# Altium schematic sheet Main.SchDoc
size B; SheetNumber: 1; SheetTotal: 1
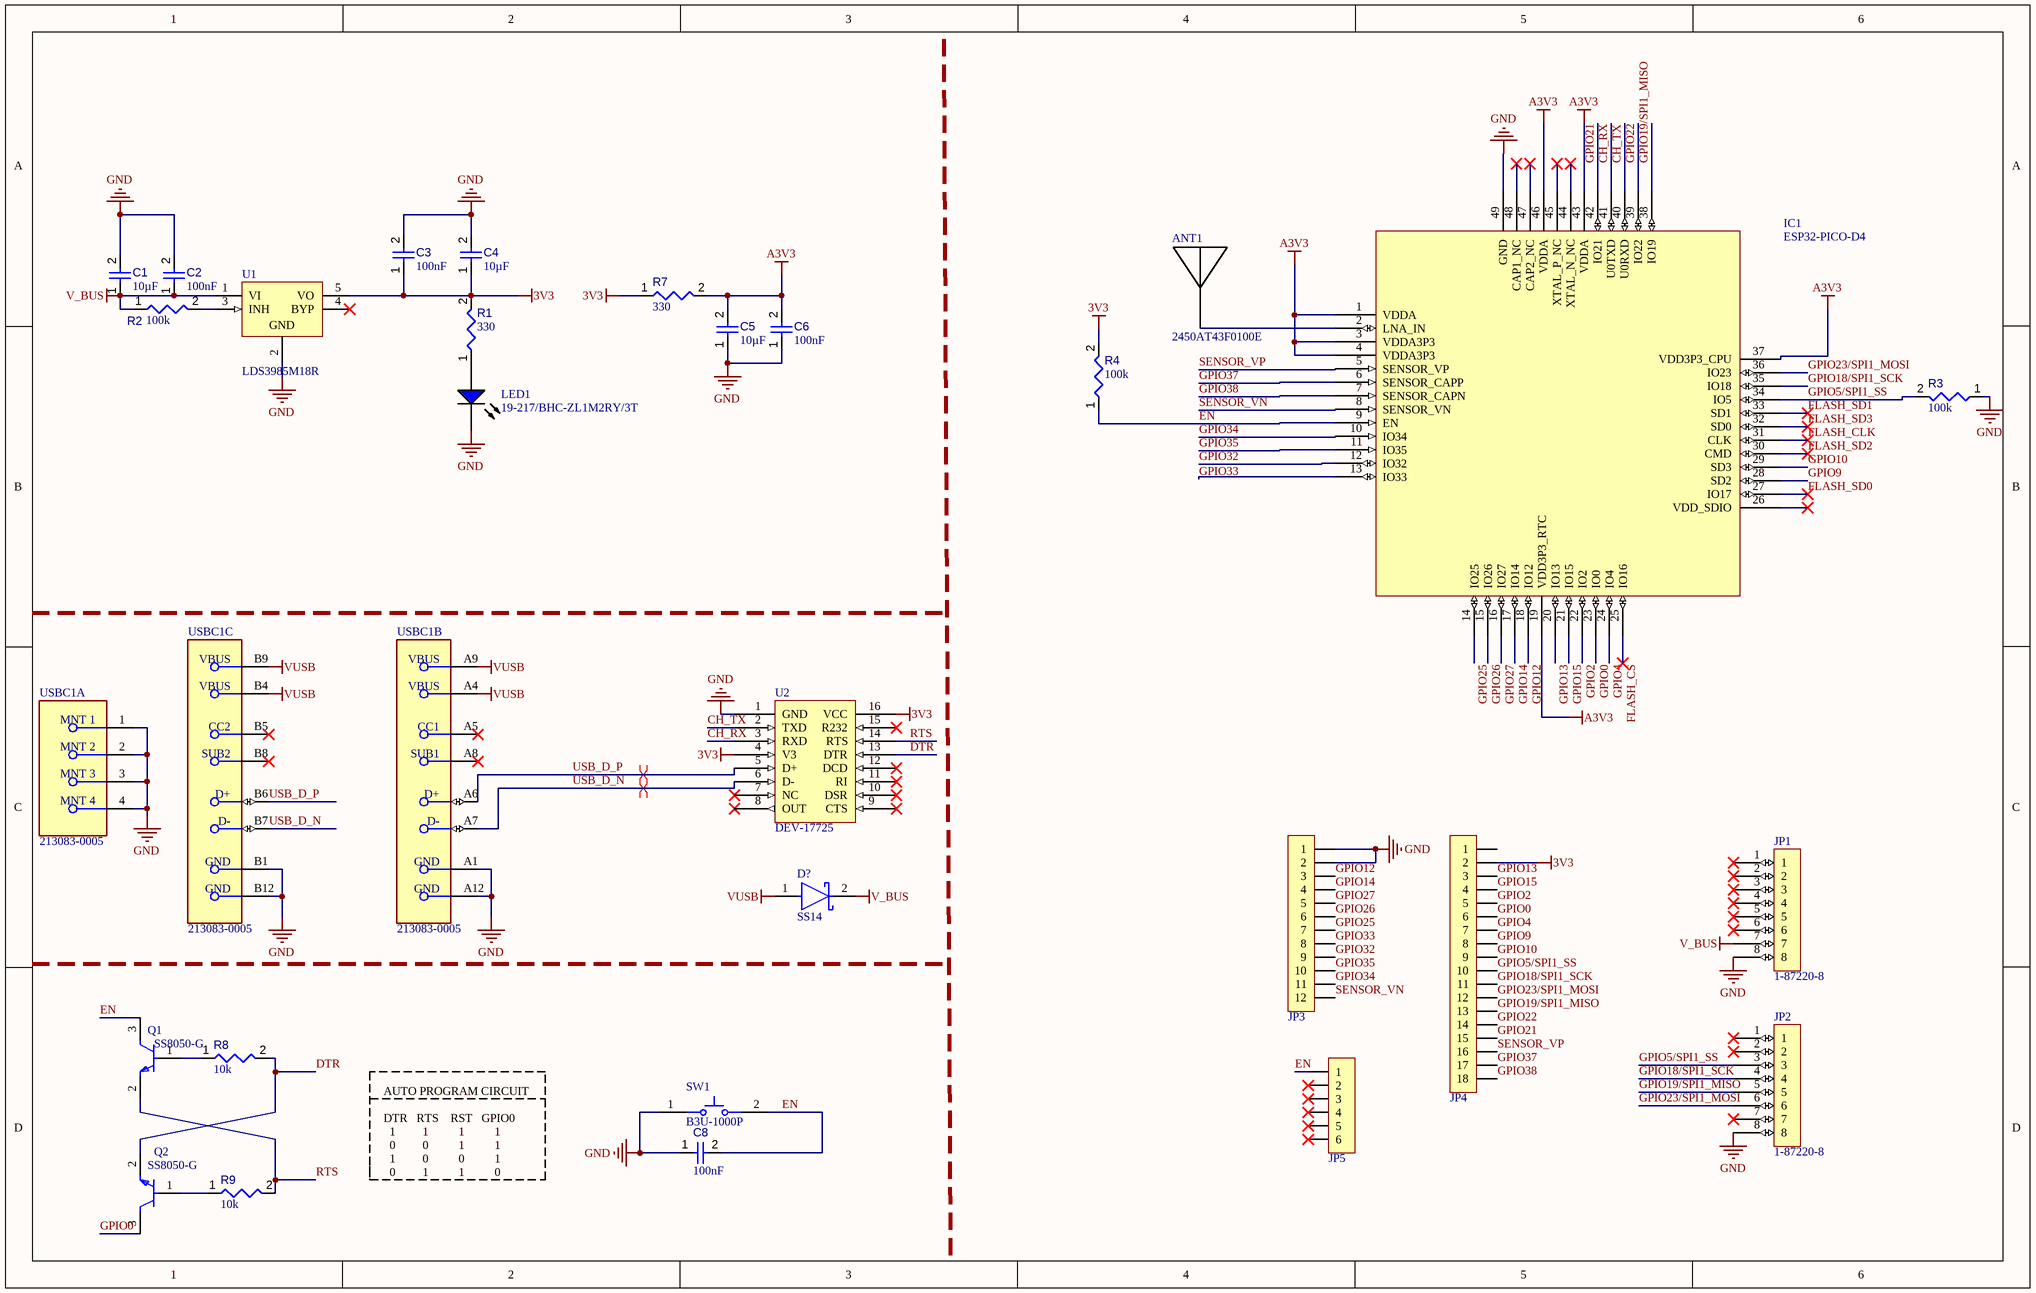
[diagram p0: Main.SchDoc]

## Parts
ANT1  2450AT43F0100E  [2450AT43F0100E-Footprint-1]
C1  value 10µF  [CAPC0603(1608)100_L]  (hidden comment: Capacitor 10µF +/-20% 10V 0603)
C2  value 100nF  [CAPC0402(1005)60_L]  (hidden comment: Capacitor 100nF +/-20% 10V 0402)
C3  value 100nF  [CAPC0402(1005)60_L]  (hidden comment: Capacitor 100nF +/-20% 10V 0402)
C4  value 10µF  [CAPC0603(1608)100_L]  (hidden comment: Capacitor 10µF +/-20% 10V 0603)
C5  value 10µF  [CAPC0603(1608)100_L]  (hidden comment: Capacitor 10µF +/-20% 10V 0603)
C6  value 100nF  [CAPC0402(1005)60_L]  (hidden comment: Capacitor 100nF +/-20% 10V 0402)
C8  value 100nF  [CAPC0402(1005)60_L]  (hidden comment: Capacitor 100nF +/-20% 10V 0402)
D?  SS14  [DIOM4427X25N]
IC1  ESP32-PICO-D4  [QFN50P700X700X104_HS-49N]
JP1  1-87220-8  [1-87220-8-Footprint-1]
JP2  1-87220-8  [1-87220-8-Footprint-1]
JP3  HDR-1X12  [HDR2.54-LI-12P]  (value not drawn)
JP4  HDR-1X18  [HDR2.54-LI-18P]  (value not drawn)
JP5  HDR-1X6  [HDR2.54-LI-6P]  (value not drawn)
LED1  19-217/BHC-ZL1M2RY/3T  [EVRL-0603-2_V]
Q1  SS8050-G  [FP-SS8050-G-IPC_A]
Q2  SS8050-G  [FP-SS8050-G-IPC_A]
R1  value 330  [RESC0402(1005)_L]  (hidden comment: Resistor 330R +/-5 % 0402 63 mW)
R2  value 100k  [RESC0402(1005)_L]  (hidden comment: 100KR2F)
R3  value 100k  [RESC0402(1005)_L]  (hidden comment: 100KR2F)
R4  value 100k  [RESC0402(1005)_L]  (hidden comment: 100KR2F)
R7  value 330  [RESC0402(1005)_L]  (hidden comment: Resistor 330R +/-5 % 0402 63 mW)
R8  value 10k  [RESC0402(1005)_L]  (hidden comment: 10KR2F)
R9  value 10k  [RESC0402(1005)_L]  (hidden comment: 10KR2F)
SW1  B3U-1000P  [OMRON-B3U-1000_V]
U1  LDS3985M18R  [SOT23-5L_N]
U2  DEV-17725  [DEV-17725-Footprint-1]
USBC1  213083-0005  [FP-213083-0005-MFG]  (parts A,B,C of 3)

## Nets
3V3: C3.1 C4.1 JP4.2 R1.2 R4.2 R7.1 U1.5(VO) U2.4(V3) U2.16(VCC)
A3V3: C5.2 C6.2 IC1.1(VDDA) IC1.3(VDDA3P3) IC1.4(VDDA3P3) IC1.19(VDD3P3_RTC) IC1.37(VDD3P3_CPU) IC1.43(VDDA) IC1.46(VDDA) R7.2
GND: C1.2 C2.2 C3.2 C4.2 C5.1 C6.1 C8.1 IC1.49(GND) JP1.8 JP2.8 JP3.1 JP3.2 LED1.2(K) R3.1 SW1.1 U1.2(GND) U2.1(GND) USBC1.1(MNT_1) USBC1.2(MNT_2) USBC1.3(MNT_3) USBC1.4(MNT_4) USBC1.A1(GND) USBC1.A12(GND) USBC1.B1(GND) USBC1.B12(GND)
V_BUS: C1.1 C2.1 D?.2(C) JP1.7 R2.1 U1.1(VI)
VUSB: D?.1(A) USBC1.A4(VBUS) USBC1.A9(VBUS) USBC1.B4(VBUS) USBC1.B9(VBUS)
CH_RX: IC1.41(U0TXD) U2.3(RXD)
CH_TX: IC1.40(U0RXD) U2.2(TXD)
DTR: Q2.2(E) R8.2 U2.13(DTR)
EN: C8.2 IC1.9(EN) JP5.1 Q1.3(C) R4.1 SW1.2
FLASH_CLK: IC1.31(CLK)
FLASH_CS: IC1.25(IO16)
FLASH_SD0: IC1.27(IO17)
FLASH_SD1: IC1.33(SD1)
FLASH_SD2: IC1.30(CMD)
FLASH_SD3: IC1.32(SD0)
GPIO0: IC1.23(IO0) JP4.6 Q2.3(C)
GPIO2: IC1.22(IO2) JP4.5
GPIO4: IC1.24(IO4) JP4.7
GPIO5/SPI1_SS: IC1.34(IO5) JP2.3 JP4.10 R3.2
GPIO9: IC1.28(SD2) JP4.8
GPIO10: IC1.29(SD3) JP4.9
GPIO12: IC1.18(IO12) JP3.3
GPIO13: IC1.20(IO13) JP4.3
GPIO14: IC1.17(IO14) JP3.4
GPIO15: IC1.21(IO15) JP4.4
GPIO18/SPI1_SCK: IC1.35(IO18) JP2.4 JP4.11
GPIO19/SPI1_MISO: IC1.38(IO19) JP2.5 JP4.13
GPIO21: IC1.42(IO21) JP4.15
GPIO22: IC1.39(IO22) JP4.14
GPIO23/SPI1_MOSI: IC1.36(IO23) JP2.6 JP4.12
GPIO25: IC1.14(IO25) JP3.7
GPIO26: IC1.15(IO26) JP3.6
GPIO27: IC1.16(IO27) JP3.5
GPIO32: IC1.12(IO32) JP3.9
GPIO33: IC1.13(IO33) JP3.8
GPIO34: IC1.10(IO34) JP3.11
GPIO35: IC1.11(IO35) JP3.10
GPIO37: IC1.6(SENSOR_CAPP) JP4.17
GPIO38: IC1.7(SENSOR_CAPN) JP4.18
RTS: Q1.2(E) R9.2 U2.14(RTS)
SENSOR_VN: IC1.8(SENSOR_VN) JP3.12
SENSOR_VP: IC1.5(SENSOR_VP) JP4.16
USB_D_N: U2.6(D-) USBC1.A7(D-) USBC1.B7(D-)
USB_D_P: U2.5(D+) USBC1.A6(D+) USBC1.B6(D+)
NetANT1_1: ANT1.1 IC1.2(LNA_IN)
NetLED1_1: LED1.1(A) R1.1
NetQ1_1: Q1.1(B) R8.1
NetQ2_1: Q2.1(B) R9.1
NetR2_2: R2.2 U1.3(INH)

Not connected (* = marked no-connect by the designer): IC1 26(VDD_SDIO)* 44(XTAL_N_NC)* 45(XTAL_P_NC)* 47(CAP2_NC)* 48(CAP1_NC)*; JP1 1* 2* 3* 4* 5* 6*; JP2 1* 2* 7*; JP4 1; JP5 2* 3* 4* 5* 6*; U1 4(BYP)*; U2 7(NC)* 8(OUT)* 9(CTS)* 10(DSR)* 11(RI)* 12(DCD)* 15(R232)*; USBC1 A5(CC1)* A8(SUB1)* B5(CC2)* B8(SUB2)*

## Layout directives
differential pair: USB_D_N, USB_D_P

## Notes on the sheet
- AUTO PROGRAM CIRCUIT
  DTR   RTS    RST   GPIO0
  1         1          1          1
  0         0          1          1
  1         0          0          1
  0         1          1          0

## Library data of the parts
ANT1 = CMP-00025-00003-1: Antenna Chip 1dBi Gain 2500MHz 2-Pin T/R
C1 C4 C5 = CMP-001-00075-4: Chip Capacitor, 10µF +/-20%, 10V, 0603, Thickness 1 mm; Tolerance: 10%; Voltage Rating: 10V; Max Operating Temperature: 85°C; Pins: 2; Case/Package: 0603; Mounting Technology: SMT; Min Operating Temperature: -55°C
C2 C3 C6 C8 = CMP-001-00061-3: Chip Capacitor, 100nF +/-20%, 10V, 0402, Thickness 0.6 mm; Tolerance: 20%; Mounting Technology: SMT; Voltage Rating: 10V; Max Operating Temperature: 85°C; Pins: 2; Case/Package: 0402; Min Operating Temperature: -55°C
D? = CMP-004-00031-1: Schottky Diodes & Rectifiers SMA 40V 1.0A; ComponentLink1Description: Mouser Link; ComponentLink1URL: https://www.mouser.com/ProductDetail/onsemi-Fairchild/SS14?qs=mVVXn4M53U%252BvrBaFv5vr4w%3D%3D
IC1 = CMP-021-00007-1: RF System on a Chip - SoC SIP module ESP32 with 4MByte Flash, Dual Core MCU, Wi-Fi & Bluetooth Combo, LGA48-pin, 7*7mm
JP1 JP2 = CMP-002-00072-1: Conn Unshrouded Header HDR 1x8 POS 2.54mm Solder ST Thru-Hole Carton
JP3 = Header 12: 12P接插件; 联系卖家，免费查找封装: 唯一出售店铺网址https://shop463601444.taobao.com; 封装库来自淘宝卖家ID:黄晶宝石: 其他店铺购入均为盗版假冒封装库，请立即申请退款，本店现金奖励20~200元; BOM名称: 12P接插件
JP4 = Header 18: 18P接插件; 联系卖家，免费查找封装: 唯一出售店铺网址https://shop463601444.taobao.com; 封装库来自淘宝卖家ID:黄晶宝石: 其他店铺购入均为盗版假冒封装库，请立即申请退款，本店现金奖励20~200元; BOM名称: 18P接插件
JP5 = Header 6: 6P接插件; 联系卖家，免费查找封装: 唯一出售店铺网址https://shop463601444.taobao.com; 封装库来自淘宝卖家ID:黄晶宝石: 其他店铺购入均为盗版假冒封装库，请立即申请退款，本店现金奖励20~200元; BOM名称: 6P接插件
LED1 = CMP-007-00003-2: Chip LED, Blue, 5 V, 25 mA, -40 to 85 degC, 2-Pin SMD (0603), RoHS, Tape and Reel; Manufacturer: Everlight Electronics; Luminous Intensity: 28.5mcd; Viewing Angle: 120degrees; Forward Current: 25mA; Lens Style: Diffused; Forward Voltage: 3V; Pins: 2; Max Operating Temperature: 85°C; Manufacturer URL: http://www.everlight.com/; Datasheet URL: https://datasheet.ciiva.com/26901/getdatasheetpartid-420616-26901324.pdf; Package Reference: 0603; RoHS Compliant: True; Packaging: TapeandReel; Package Description: 2-Pin Surface Mount Device, Body 1.6 x 0.8 mm; Mounting Technology: SM; Datasheet Version: Rev. 1.0, 03/2003; Min Operating Temperature: -40°C; Case/Package: 0603; Colour: Blue
Q1 Q2 = CMP-013-00034-1: Bipolar Transistors - BJT NPN TRANSISTOR 1.5A 40V; Max Power Dissipation: 300mW; Collector Emitter Breakdown Voltage: 25V; Collector-emitter Voltage-Max: 400mV; Case/Package: TO-236-3; Max Breakdown Voltage: 25V; Max Collector Current: 1.5A; Mounting Technology: Surface Mount; Series: -
R1 R7 = CMP-009-00132-3: Chip Resistor, 330 Ohms, +/-5 %, 63 mW, -55 to 155 degC, 0402; Power: 63mW; Tolerance: 5%; Pins: 2; Max Operating Temperature: 155°C; Min Operating Temperature: -55°C; Case/Package: 0402
R2-R4 = CMP-009-00064-2: 100K 0.063W 1% 0402 (1005 Metric)  SMD; Power: 63mW; Case/Package: 0402; Mounting Technology: SMT; Pins: 2; Tolerance: 1%
R8 R9 = CMP-009-00066-2: 10K 0.063W 1% 0402 (1005 Metric)  SMD; Power: 63mW; Case/Package: 0402; Mounting Technology: SMT; Pins: 2; Tolerance: 1%
SW1 = CMP-011-00000-2: Tactile Switch, SPST-NO, 0.05 A, 12 V, -25 to 70 degC, 2-Pin SMD, RoHS, Tape and Reel; Manufacturer: Omron Electronic Components; IP Rating: IP40; Current Rating: 50mA; Max Contact Resistance: 100mohm; Operating Force: 153gf; Throw Configuration: SPST; Resistance: 0.1Ohm; Max Voltage Rating (DC): 12V; Contact Material: Silver; Max Current Rating: 50mA; Datasheet URL: http://www.omron.com/ecb/products/pdf/en-b3u.pdf; Mounting Technology: SM; Case/Package: B3U-1000; Packaging: TapeandReel; Package Reference: B3U-1000; Manufacturer URL: http://www.omron.com/; Datasheet Version: Jan-15; RoHS Compliant: True; Max Operating Temperature: 70°C; Contact Current Rating: 50mA; Package Quantity: 3500; Package Description: 2-Pin Surface Mount Device, Body 3 x 2.5 mm; Voltage Rating (DC): 12V; Min Operating Temperature: -25°C; Voltage Rating: 12V
U1 = CMP-019-00049-1: LDS3985 Series 1.8 V 300 mA Fixed Surface Mount Voltage Regulator - SOT-23-5; Max Supply Current: 300uA; Output Voltage: 1.8V; Number of Regulators: 1; Output Configuration: Positive; Max Supply Voltage: 6V; Power Supply Rejection Ratio (PSRR): 50dB; Input Bias Current: 85uA; Output Current: 300mA; Min Input Voltage: 2.5V; Quiescent Current: 150uA; Min Operating Temperature: -40°C; Radiation Hardening: No; Case/Package: SOT-23; Series: -; Packaging: Tape and Reel; Min Output Voltage: 1.8V; Lead Free: Lead Free; Number of Outputs: 1; Output Type: Fixed; RoHS Compliant: Yes; Polarity: Positive; Max Output current: 300mA; Max Operating Temperature: 125°C; Pins: 5; Mounting Technology: Surface Mount; Package Quantity: 3000
U2 = CMP-015-00008-3: Sparkfun Micromod Update Tool CH340C
USBC1 = CMP-002-00073-2: Connector USB Type C Receptacle 16 Position 0.5mm Surface Mount Right Angle Emboss T/R